# Altium schematic sheet PWM_OUTS.SchDoc
size Letter
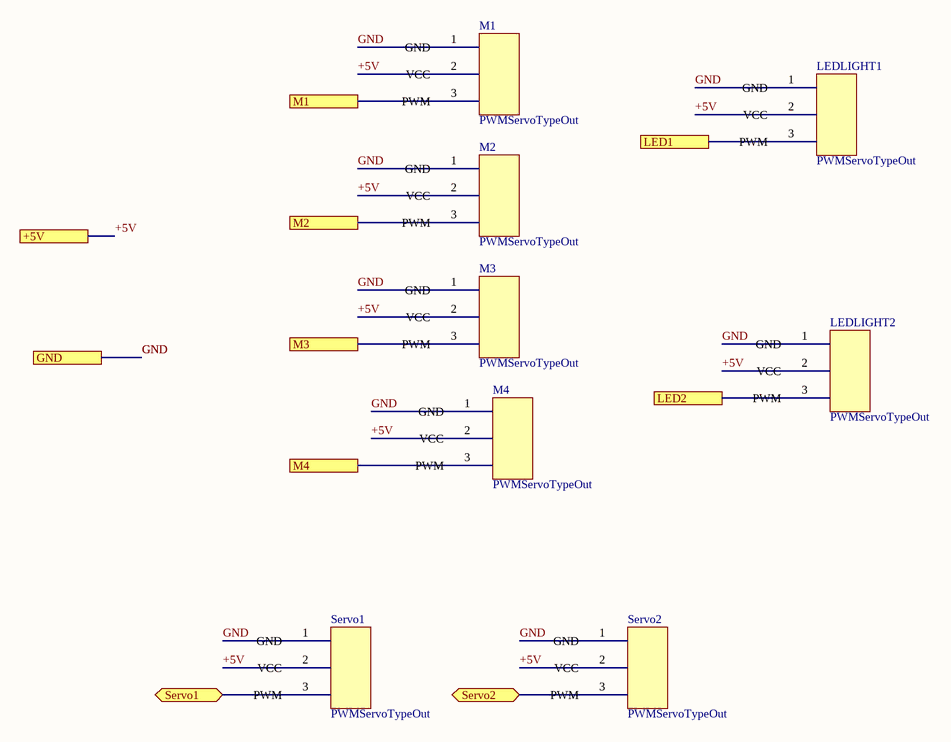
[diagram p0: PWM_OUTS.SchDoc]

## Parts
LEDLIGHT1  PWMServoTypeOut  [HDR1X3]
LEDLIGHT2  PWMServoTypeOut  [HDR1X3]
M1  PWMServoTypeOut  [HDR1X3]
M2  PWMServoTypeOut  [HDR1X3]
M3  PWMServoTypeOut  [HDR1X3]
M4  PWMServoTypeOut  [HDR1X3]
Servo1  PWMServoTypeOut  [HDR1X3]
Servo2  PWMServoTypeOut  [HDR1X3]

## Ports
+5V, GND, LED1, LED2, M1, M2, M3, M4, Servo1, Servo2

## Nets
+5V: LEDLIGHT1.2(VCC) LEDLIGHT2.2(VCC) M1.2(VCC) M2.2(VCC) M3.2(VCC) M4.2(VCC) Servo1.2(VCC) Servo2.2(VCC) ; port +5V
GND: LEDLIGHT1.1(GND) LEDLIGHT2.1(GND) M1.1(GND) M2.1(GND) M3.1(GND) M4.1(GND) Servo1.1(GND) Servo2.1(GND) ; port GND
LED1: LEDLIGHT1.3(PWM) ; port LED1
LED2: LEDLIGHT2.3(PWM) ; port LED2
M1: M1.3(PWM) ; port M1
M2: M2.3(PWM) ; port M2
M3: M3.3(PWM) ; port M3
M4: M4.3(PWM) ; port M4
Servo1: Servo1.3(PWM) ; port Servo1
Servo2: Servo2.3(PWM) ; port Servo2